# EAGLE design BareBonesArduino (EAGLE 8.0.0)
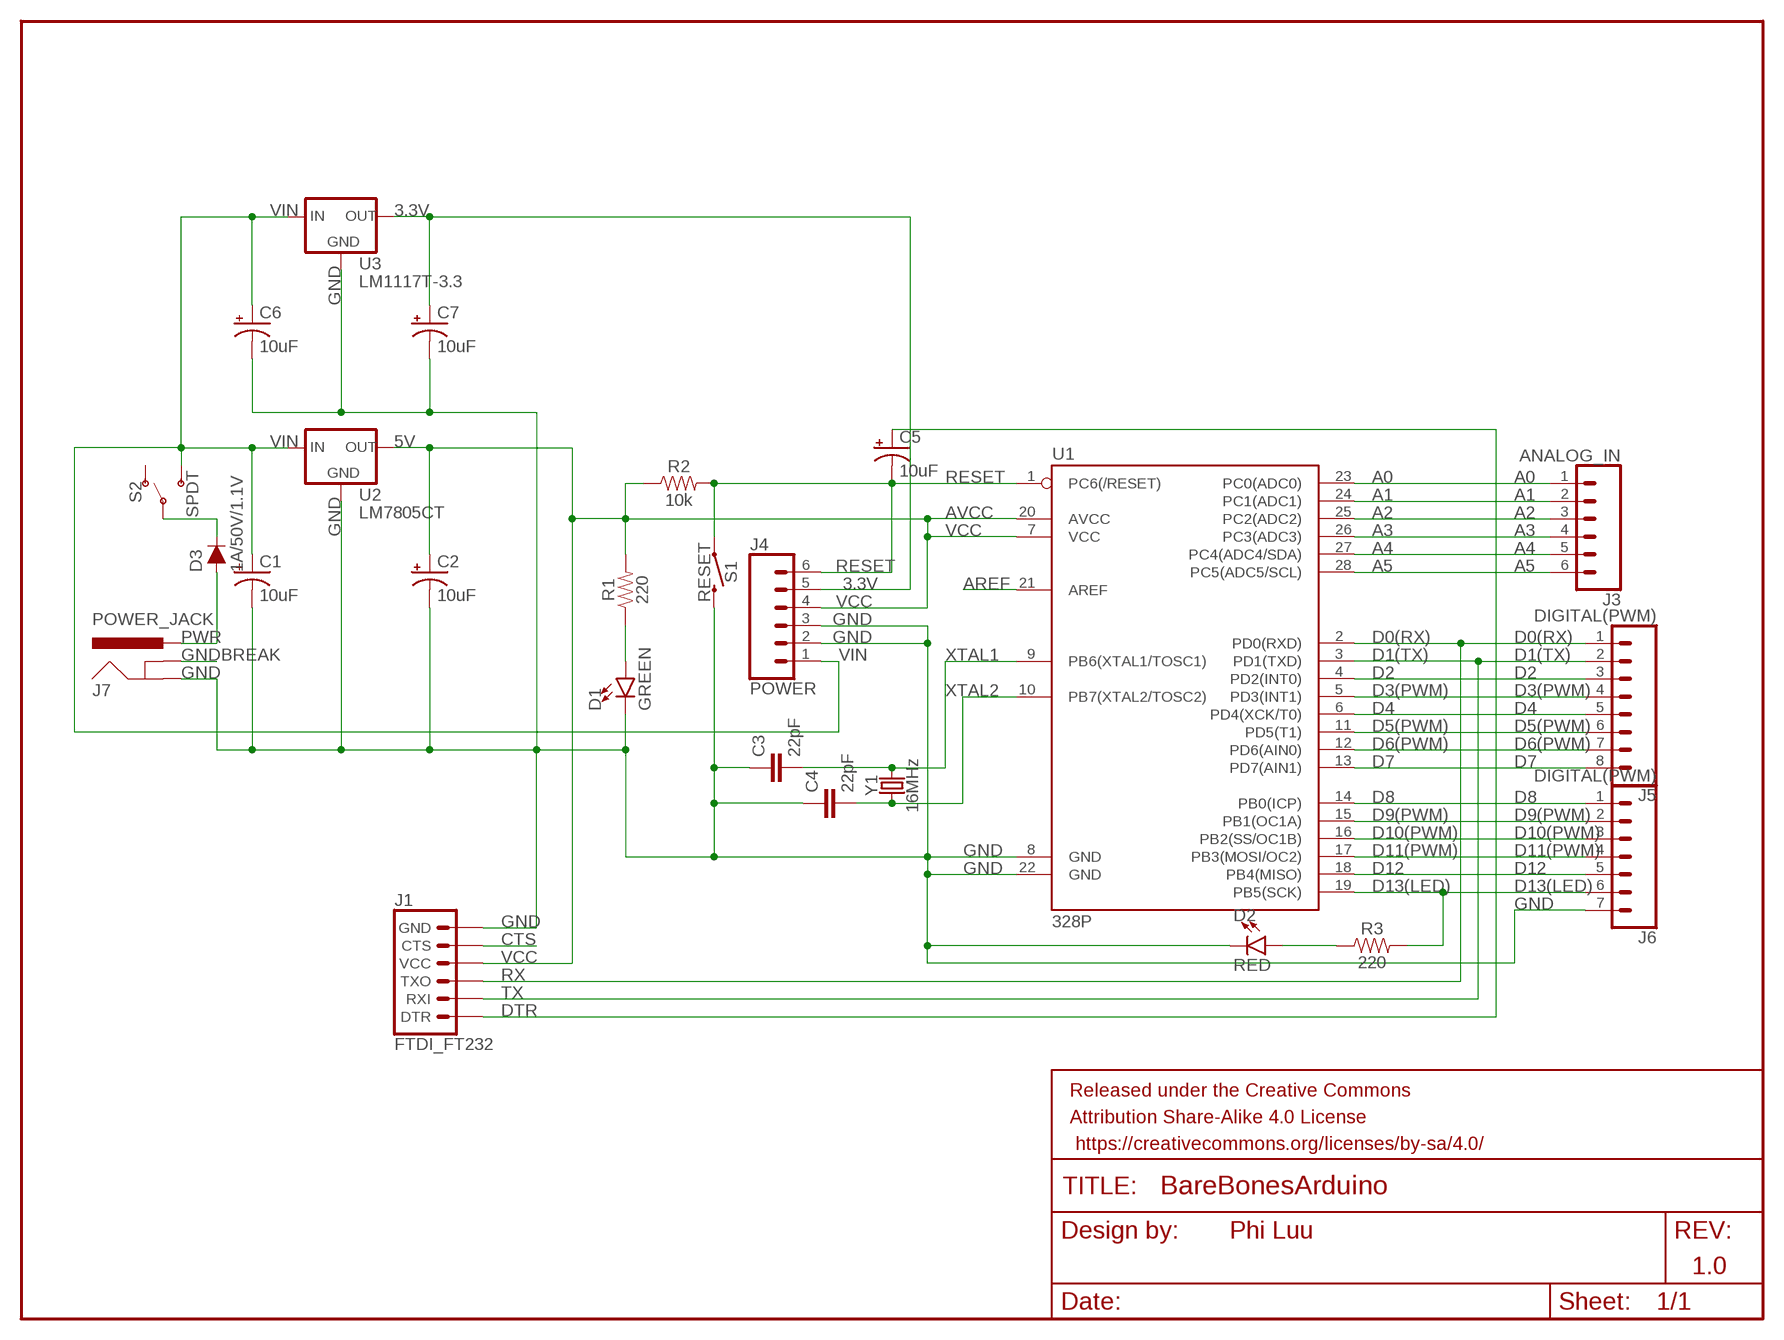
[diagram p0: schematic, sheet 1]

## Parts
C1  10uF  10UF-POLAR-RADIAL-2.5MM-25V-20%  [CPOL-RADIAL-2.5MM-5MM]
C2  10uF  10UF-POLAR-RADIAL-2.5MM-25V-20%  [CPOL-RADIAL-2.5MM-5MM]
C3  22pF  22PF-PTH-2.54MM-200V-5%  [CAP-PTH-2.54]
C4  22pF  22PF-PTH-2.54MM-200V-5%  [CAP-PTH-2.54]
C5  10uF  10UF-POLAR-RADIAL-2.5MM-25V-20%  [CPOL-RADIAL-2.5MM-5MM]
C6  10uF  10UF-POLAR-RADIAL-2.5MM-25V-20%  [CPOL-RADIAL-2.5MM-5MM]
C7  10uF  10UF-POLAR-RADIAL-2.5MM-25V-20%  [CPOL-RADIAL-2.5MM-5MM]
D1  GREEN  LED5MM  [LED_5MM]
D2  RED  LED5MM  [LED_5MM]
D3  1A/50V/1.1V  DIODE-PTH  [DIODE-1N4001]
FRAME1  FRAME-LETTER  [CREATIVE_COMMONS]
J1  FTDI_FT232  6_PIN_SERIAL_TARGET  [1X06]
J3  ANALOG_IN  CONN_06SILK_FEMALE_PTH  [1X06]
J4  POWER  CONN_06SILK_FEMALE_PTH  [1X06]
J5  DIGITAL(PWM)  CONN_08"  [1X08]
J6  DIGITAL(PWM)  CONN_07  [1X07]
J7  POWER_JACK  [POWER_JACK_PTH]
R1  220  1KOHM-HORIZ-1/4W-5%  [AXIAL-0.3]
R2  10k  10KOHM-HORIZ-1/4W-5%  [AXIAL-0.3]
R3  220  1KOHM-HORIZ-1/4W-5%  [AXIAL-0.3]
S1  RESET  MOMENTARY-SWITCH-SPST-PTH-6.0MM  [TACTILE_SWITCH_PTH_6.0MM]
S2  SPDT  SWITCH-SPDT-PTH-11.6X4.0MM  [SWITCH_SPDT_PTH_11.6X4.0MM]
U1  328P  ATMEGA328P_PDIP  [DIP28]
U2  LM7805CT  V_REG_78XX-TO-220  [TO-220-ALT]
U3  LM1117T-3.3  V_REG_LD1117VXX  [78XXL]
Y1  16MHz  CRYSTAL-16MHZPTH-HC49US  [HC49US]

## Nets
3.3V: C7.1(+) J4.5 U3.GND(OUT)
A0: J3.1 U1.23(PC0(ADC0))
A1: J3.2 U1.24(PC1(ADC1))
A2: J3.3 U1.25(PC2(ADC2))
A3: J3.4 U1.26(PC3(ADC3))
A4: J3.5 U1.27(PC4(ADC4/SDA))
A5: J3.6 U1.28(PC5(ADC5/SCL))
AREF: U1.21(AREF)
CTS: J1.5(CTS)
D0(RX): J1.3(TXO) J5.1 U1.2(PD0(RXD))
D1(TX): J1.2(RXI) J5.2 U1.3(PD1(TXD))
D2: J5.3 U1.4(PD2(INT0))
D3(PWM): J5.4 U1.5(PD3(INT1))
D4: J5.5 U1.6(PD4(XCK/T0))
D5(PWM): J5.6 U1.11(PD5(T1))
D6(PWM): J5.7 U1.12(PD6(AIN0))
D7: J5.8 U1.13(PD7(AIN1))
D8: J6.1 U1.14(PB0(ICP))
D9(PWM): J6.2 U1.15(PB1(OC1A))
D10(PWM): J6.3 U1.16(PB2(SS/OC1B))
D11(PWM): J6.4 U1.17(PB3(MOSI/OC2))
D12: J6.5 U1.18(PB4(MISO))
D13(LED): J6.6 R3.P$2 U1.19(PB5(SCK))
DTR: C5.1(+) J1.1(DTR)
GND: C1.2(-) C2.2(-) C3.1 C4.1 C6.2(-) C7.2(-) D1.K(C) D2.K(C) J1.6(GND) J4.2 J4.3 J6.7 J7.GND S1.3 U1.8(GND) U1.22(GND) U2.GND U3.IN(GND)
GNDBREAK: J7.GNDBREAK
N$1: D2.A R3.P$1
N$2: D3.C S2.2(P)
N$3: D1.A R1.P$1
PWR: D3.A J7.PWR
RESET: C5.2(-) J4.6 R2.P$2 S1.1 U1.1(PC6(/RESET))
VCC: C2.1(+) J1.4(VCC) J4.4 R1.P$2 R2.P$1 U1.7(VCC) U1.20(AVCC) U2.OUT
VIN: C1.1(+) C6.1(+) J4.1 S2.3(S) U2.IN U3.OUT(IN)
XTAL1: C3.2 U1.9(PB6(XTAL1/TOSC1)) Y1.2
XTAL2: C4.2 U1.10(PB7(XTAL2/TOSC2)) Y1.1
Unconnected: S2.1(O)

## Notes on the sheet
- 5V
- AVCC
- GND
- RX
- TX
- Phi Luu
- 1.0

## Library data of the parts
C1 C2 C5-C7 = SparkFun-Capacitors:10UF-POLAR: 10.0µF polarized capacitors A capacitor is a passive two-terminal electrical component used to store electrical energy temporarily in an electric field.; PROD_ID: CAP-08440
C3 C4 = SparkFun-Capacitors:22PF: 22pF ceramic capacitors A capacitor is a passive two-terminal electrical component used to store electrical energy temporarily in an electric field.; PROD_ID: CAP-09128
D1 D2 = SparkFun-LED:LED: LED (Generic) Standard schematic elements and footprints for 5mm, 3mm, 1206, and 0603 sized LEDs. Generic LEDs with no color specified.
D3 = SparkFun-DiscreteSemi:DIODE: Diode These are standard reverse protection diodes and small signal diodes. SparkFun Products: SparkFun SparkPunk Sound Kit <https://www.sparkfun.com/products/11177> SparkFun ESP8266 Thing <https://www.sparkfun.com/products/13231>; PROD_ID: DIO-09176
FRAME1 = SparkFun-Aesthetics:FRAME-LETTER: Schematic Frame - Letter Standard 8.5x11 US Letter frame
J1 = SparkFun-Connectors:6_PIN_SERIAL_TARGET: 6-pin header connection for use with the "FTDI BASIC" pinout - TARGET SIDE. Also known as "Arduino Serial Program Header". It is used to mate with our FTDI Basic serial programmers using the Arduino IDE. Note, this device has "TARGET" in the name. It is intended to be used on a design that contains a target micro-controller that you wish to program. The "sister" device, named "CABLE" is inteneded to be used on a design that usually lives on the end of your USB cable and prvides the converter chip (FTDI232 or FTDI231x) to commnicate serial RX/TX. You can populate with some of these: Break Away Headers - Straight <https://www.sparkfun.com/products/116> (PRT-00116) For reference (or to suit your programming needs) check out these designs: SparkFun FTDI Basic Breakout - 5V <https://www.sparkfun.com/products/9716> (DEV-09716) SparkFun FTDI Basic Breakout - 3.3V <https://www.sparkfun.com/products/9873> (DEV-09873) SparkFun FTDI SmartBasic <https://www.sparkfun.com/products/12935> (DEV-12935) SparkFun Beefy 3 - FTDI Basic Breakout <https://www.sparkfun.com/products/13746> (DEV-13746)
J3 J4 = SparkFun-Connectors:CONN_06: Multi connection point. Often used as Generic Header-pin footprint for 0.1 inch spaced/style header connections On any of the 0.1 inch spaced packages, you can populate with these: Break Away Headers - Straight <https://www.sparkfun.com/products/116> (PRT-00116) Break Away Male Headers - Right Angle <https://www.sparkfun.com/products/553> (PRT-00553) Female Headers <https://www.sparkfun.com/products/115> (PRT-00115) Break Away Headers - Machine Pin <https://www.sparkfun.com/products/117> (PRT-00117) Break Away Female Headers - Swiss Machine Pin <https://www.sparkfun.com/products/743> (PRT-00743) Arduino Stackable Header - 6 Pin <https://www.sparkfun.com/products/9280> (PRT-09280) For SCREWTERMINALS and SPRING TERMINALS visit here: Screw Terimnals on SparkFun.com <https://www.sparkfun.com/search/results?term=Screw+Terminals> (5mm/3.5mm/2.54mm spacing) This device is also useful as a general connection point to wire up your design to another part of your project. Our various solder wires solder well into these plated through hole pads. Hook-Up Wire - Assortment (Stranded, 22 AWG) <https://www.sparkfun.com/products/11375> (PRT-11375) Hook-Up Wire - Assortment (Solid Core, 22 AWG) <https://www.sparkfun.com/products/11367> (PRT-11367) View the entire wire category on our website here <https://www.sparkfun.com/categories/141>; PROD_ID: CONN-08437
J5 = SparkFun-Connectors:CONN_08: Multi connection point. Often used as Generic Header-pin footprint for 0.1 inch spaced/style header connections On any of the 0.1 inch spaced packages, you can populate with these: Break Away Headers - Straight <https://www.sparkfun.com/products/116> (PRT-00116) Break Away Male Headers - Right Angle <https://www.sparkfun.com/products/553> (PRT-00553) Female Headers <https://www.sparkfun.com/products/115> (PRT-00115) Break Away Headers - Machine Pin <https://www.sparkfun.com/products/117> (PRT-00117) Break Away Female Headers - Swiss Machine Pin <https://www.sparkfun.com/products/743> (PRT-00743) Arduino Stackable Header - 8 Pin <https://www.sparkfun.com/products/9279> (PRT-09279) For SCREWTERMINALS and SPRING TERMINALS visit here: Screw Terimnals on SparkFun.com <https://www.sparkfun.com/search/results?term=Screw+Terminals> (5mm/3.5mm/2.54mm spacing) This device is also useful as a general connection point to wire up your design to another part of your project. Our various solder wires solder well into these plated through hole pads. Hook-Up Wire - Assortment (Stranded, 22 AWG) <https://www.sparkfun.com/products/11375> (PRT-11375) Hook-Up Wire - Assortment (Solid Core, 22 AWG) <https://www.sparkfun.com/products/11367> (PRT-11367) View the entire wire category on our website here <https://www.sparkfun.com/categories/141> Special notes: Molex polarized connector foot print use with SKU : PRT-08231 with associated crimp pins and housings. 1MM SMD Version SKU: PRT-10208 NOTES ON THE VARIANTS LOCK and LOCK_LONGPADS... This footprint was designed to help hold the alignment of a through-hole component (i.e. 6-pin header) while soldering it into place. You may notice that each hole has been shifted either up or down by 0.005 of an inch from it's more standard position (which is a perfectly straight line). This slight alteration caused the pins (the squares in the middle) to touch the edges of the holes. Because they are alternating, it causes a "brace" to hold the component in place. 0.005 has proven to be the perfect amount of "off-center" position when using our standard breakaway headers. Although looks a little odd when you look at the bare footprint, once you have a header in there, the alteration is very hard to notice. Also,if you push a header all the way into place, it is covered up entirely on the bottom side.; PROD_ID: CONN-08438
J6 = SparkFun-Connectors:CONN_07: Multi connection point. Often used as Generic Header-pin footprint for 0.1 inch spaced/style header connections On any of the 0.1 inch spaced packages, you can populate with these: Break Away Headers - Straight <https://www.sparkfun.com/products/116> (PRT-00116) Break Away Male Headers - Right Angle <https://www.sparkfun.com/products/553> (PRT-00553) Female Headers <https://www.sparkfun.com/products/115> (PRT-00115) Break Away Headers - Machine Pin <https://www.sparkfun.com/products/117> (PRT-00117) Break Away Female Headers - Swiss Machine Pin <https://www.sparkfun.com/products/743> (PRT-00743) For SCREWTERMINALS and SPRING TERMINALS visit here: Screw Terimnals on SparkFun.com <https://www.sparkfun.com/search/results?term=Screw+Terminals> (5mm/3.5mm/2.54mm spacing) This device is also useful as a general connection point to wire up your design to another part of your project. Our various solder wires solder well into these plated through hole pads. Hook-Up Wire - Assortment (Stranded, 22 AWG) <https://www.sparkfun.com/products/11375> (PRT-11375) Hook-Up Wire - Assortment (Solid Core, 22 AWG) <https://www.sparkfun.com/products/11367> (PRT-11367) View the entire wire category on our website here <https://www.sparkfun.com/categories/141> Special notes: Molex polarized connector foot print use with SKU : PRT-08231 with associated crimp pins and housings. 1MM SMD Version SKU: PRT-10208 NOTES ON THE VARIANTS LOCK and LOCK_LONGPADS... This footprint was designed to help hold the alignment of a through-hole component (i.e. 6-pin header) while soldering it into place. You may notice that each hole has been shifted either up or down by 0.005 of an inch from it's more standard position (which is a perfectly straight line). This slight alteration caused the pins (the squares in the middle) to touch the edges of the holes. Because they are alternating, it causes a "brace" to hold the component in place. 0.005 has proven to be the perfect amount of "off-center" position when using our standard breakaway headers. Although looks a little odd when you look at the bare footprint, once you have a header in there, the alteration is very hard to notice. Also,if you push a header all the way into place, it is covered up entirely on the bottom side.
J7 = SparkFun-Connectors:POWER_JACK: Power Jack Connector This is the standard 5.5mm barrel jack for power. The PTH is the most common, proven, reliable, footprint. The Slot footprint only works if the mill layer is transmitted to the PCB fab house so be warned. Here are the connectors we sell at SparkFun: DC Barrel Power Jack/Connector <https://www.sparkfun.com/products/119> (PRT-00119) DC Barrel Power Jack/Connector (SMD) <https://www.sparkfun.com/products/12748> (PRT-12748) DC Barrel Jack Adapter - Breadboard Compatible <https://www.sparkfun.com/products/10811> (PRT-10811) It is used on this SparkFun product (and many, many others): SparkFun RedBoard - Programmed with Arduino <https://www.sparkfun.com/products/12757> (DEV-12757) Also, if you need a mating power supply or connector, please check these out: Wall Adapter Power Supply - 9VDC 650mA <https://www.sparkfun.com/products/298> (TOL-00298) DC Barrel Jack Adapter - Male <https://www.sparkfun.com/products/10287> (PRT-10287); PROD_ID: CONN-08197
R1 R3 = SparkFun-Resistors:1KOHM: 1kΩ resistor A resistor is a passive two-terminal electrical component that implements electrical resistance as a circuit element. Resistors act to reduce current flow, and, at the same time, act to lower voltage levels within circuits. - Wikipedia; PROD_ID: RES-08380; VALUE: 1k
R2 = SparkFun-Resistors:10KOHM: 10kΩ resistor A resistor is a passive two-terminal electrical component that implements electrical resistance as a circuit element. Resistors act to reduce current flow, and, at the same time, act to lower voltage levels within circuits. - Wikipedia; PROD_ID: RES-09435
S1 = SparkFun-Switches:MOMENTARY-SWITCH-SPST: Momentary Switch (Pushbutton) - SPST Normally-open (NO) SPST momentary switches (buttons, pushbuttons). Variants PTH-12MM - 12mm square, through-hole Momentary Pushbutton Switch - 12mm Square <https://www.sparkfun.com/products/9190> (COM-09190) PTH-6.0MM, PTH-6.0MM-KIT - 6.0mm square, through-hole Mini Pushbutton Switch <https://www.sparkfun.com/products/97> (COM-00097) KIT package intended for soldering kit's - only one side of pads' copper is exposed. PTH-RIGHT-ANGLE-KIT - Right-angle, through-hole Right Angle Tactile Button <https://www.sparkfun.com/products/10791> - Used on SparkFun BigTime Watch Kit <https://www.sparkfun.com/products/11734> SMD-12MM - 12mm square, surface-mount Tactile Button - SMD (12mm) <https://www.sparkfun.com/products/12993> (COM-12993) Used on SparkFun PicoBoard <https://www.sparkfun.com/products/11888> SMD-4.5MM - 4.5mm Square Trackball Switch Used on SparkFun Blackberry Trackballer Breakout <https://www.sparkfun.com/products/13169> SMD-4.6MMX2.8MM - 4.60mm x 2.80mm, surface mount Used on SparkFun SAMD21 Mini Breakout <https://www.sparkfun.com/products/13664> SMD-5.2MM, SMD-5.2-REDUNDANT - 5.2mm square, surface-mount Mini Pushbutton Switch - SMD <https://www.sparkfun.com/products/8720> (COM-08720) Used on Arduino Pro Mini <https://www.sparkfun.com/products/11114> REDUNDANT package connects both switch circuits together SMD-6.0X3.5MM - 6.0 x 3.5mm, surface mount Momentary Reset Switch SMD <https://www.sparkfun.com/products/8229> (COM-08229) SMD-6.2MM-TALL - 6.2mm square, surface mount Tactile Button - SMD (6mm) <https://www.sparkfun.com/products/12992> Used on SparkFun Digital Sandbox <https://www.sparkfun.com/products/12651> SMD-RIGHT-ANGLE - Right-angle, surface mount Used on SparkFun Block for Intel® Edison - Arduino <https://www.sparkfun.com/products/13036>; PROD_ID: SWCH-08441; SF_SKU: COM-00097
S2 = SparkFun-Switches:SWITCH-SPDT: Single Pole, Double Throw (SPDT) Switch Single-pole, double-throw (SPDT) switch. Variant Overview SMD-AYZ0202 Surface Mount DPDT Switch <https://www.sparkfun.com/products/597> (COM-00597) Used on e.g. LilyPad Arduino USB - ATmega32U4 Board <https://www.sparkfun.com/products/12049> PTH-11.6X4.0MM SPDT Mini Power Switch <https://www.sparkfun.com/products/102> (COM-00102) Used on e.g. SparkFun Simon Says - Through-Hole Soldering Kit <https://www.sparkfun.com/products/10547> (KIT-10547) PTH-11.6X4.0MM-KIT KIT version of SPDT Mini Power Switch - Simplifies soldering by removing tStop of switch pins - only one side can be soldered. PTH-11.6X4.0MM-LOCK LOCK version of SPDT Mini Power Switch - Offset pins hold switch in place for easier soldering. SMD-RIGHT-ANGLE Surface Mount Right Angle Switch <https://www.sparkfun.com/products/10860> (COM-10860) Used on e.g. SparkFun ESP8266 Thing <https://www.sparkfun.com/products/13231>; PROD_ID: SWCH-08261; SF_SKU: COM-00102
U1 = SparkFun-IC-Microcontroller:ATMEGA328P_PDIP: Atmel 328P Through hole ATMEGA328P uC used in the Arduino 32kb flash, 1k EEPROM, 2k SRAM Datasheet <http://www.sparkfun.com/datasheets/Components/SMD/ATMega328.pdf> SparkFun Products Storefront component: AVR 28 Pin 20MHz 32K 6A/D - ATMega328P <https://www.sparkfun.com/products/9061> (COM-09061) SparkFun Simon Says - Through-Hole Soldering Kit <https://www.sparkfun.com/products/10547> (KIT-10547) SparkFun Learn to Solder - Simon Says <https://www.sparkfun.com/products/13708> (KIT-13708) SparkFun BigTime Watch Kit <https://www.sparkfun.com/products/11734> (KIT-11734) SparkFun ClockIt <https://www.sparkfun.com/products/10930> (KIT-10930) SparkFun Serial Enabled LCD Kit <https://www.sparkfun.com/products/10097> (LCD-10097) SparkFun Simon Tilts - Through Hole Soldering Kit <https://www.sparkfun.com/products/12634> (KIT-12634) SparkFun Frequency Counter Kit <https://www.sparkfun.com/products/10140> (KIT-10140) FabFM Radio Kit <https://www.sparkfun.com/products/11043> (KIT-11043) SparkFun Binary Blaster Kit <https://www.sparkfun.com/products/12037> (KIT-12037) SparkFun Metro-Gnome <https://www.sparkfun.com/products/9236> (KIT-09236) ATmega328 with Arduino Optiboot (Uno) <https://www.sparkfun.com/products/10524> (DEV-10524); PROD_ID: IC-09136
U2 = SparkFun-IC-Power:V_REG_78XX: Voltage Regulator Standard 78xx regulator. IGO (Input Ground Output). Spark Fun Electronics SKU : COM-00107; PROD_ID: VREG-08450; SF_ID: COM-00107
U3 = SparkFun-IC-Power:V_REG_LD1117VXX: LD1117VXX voltage regulator. We carry the 3.3V version (COM-00526) in TO-220 package.
Y1 = SparkFun-Clocks:CRYSTAL-16MHZ: 16MHz Crystal Digikey Example <http://www.digikey.com/product-search/en?keywords=535-9122-1-ND> Frequency: 16MHz Frequency Stability: ±50ppm Frequency Tolerance: ±20ppm Load Capacitance: 18pF SparkFun Products: Pro Micro -5V/16MHz <https://www.sparkfun.com/products/12640> SparkFun Serial Enabled LCD Kit <https://www.sparkfun.com/products/10097>; PROD_ID: XTAL-08181; SF_ID: COM-00536

## Board
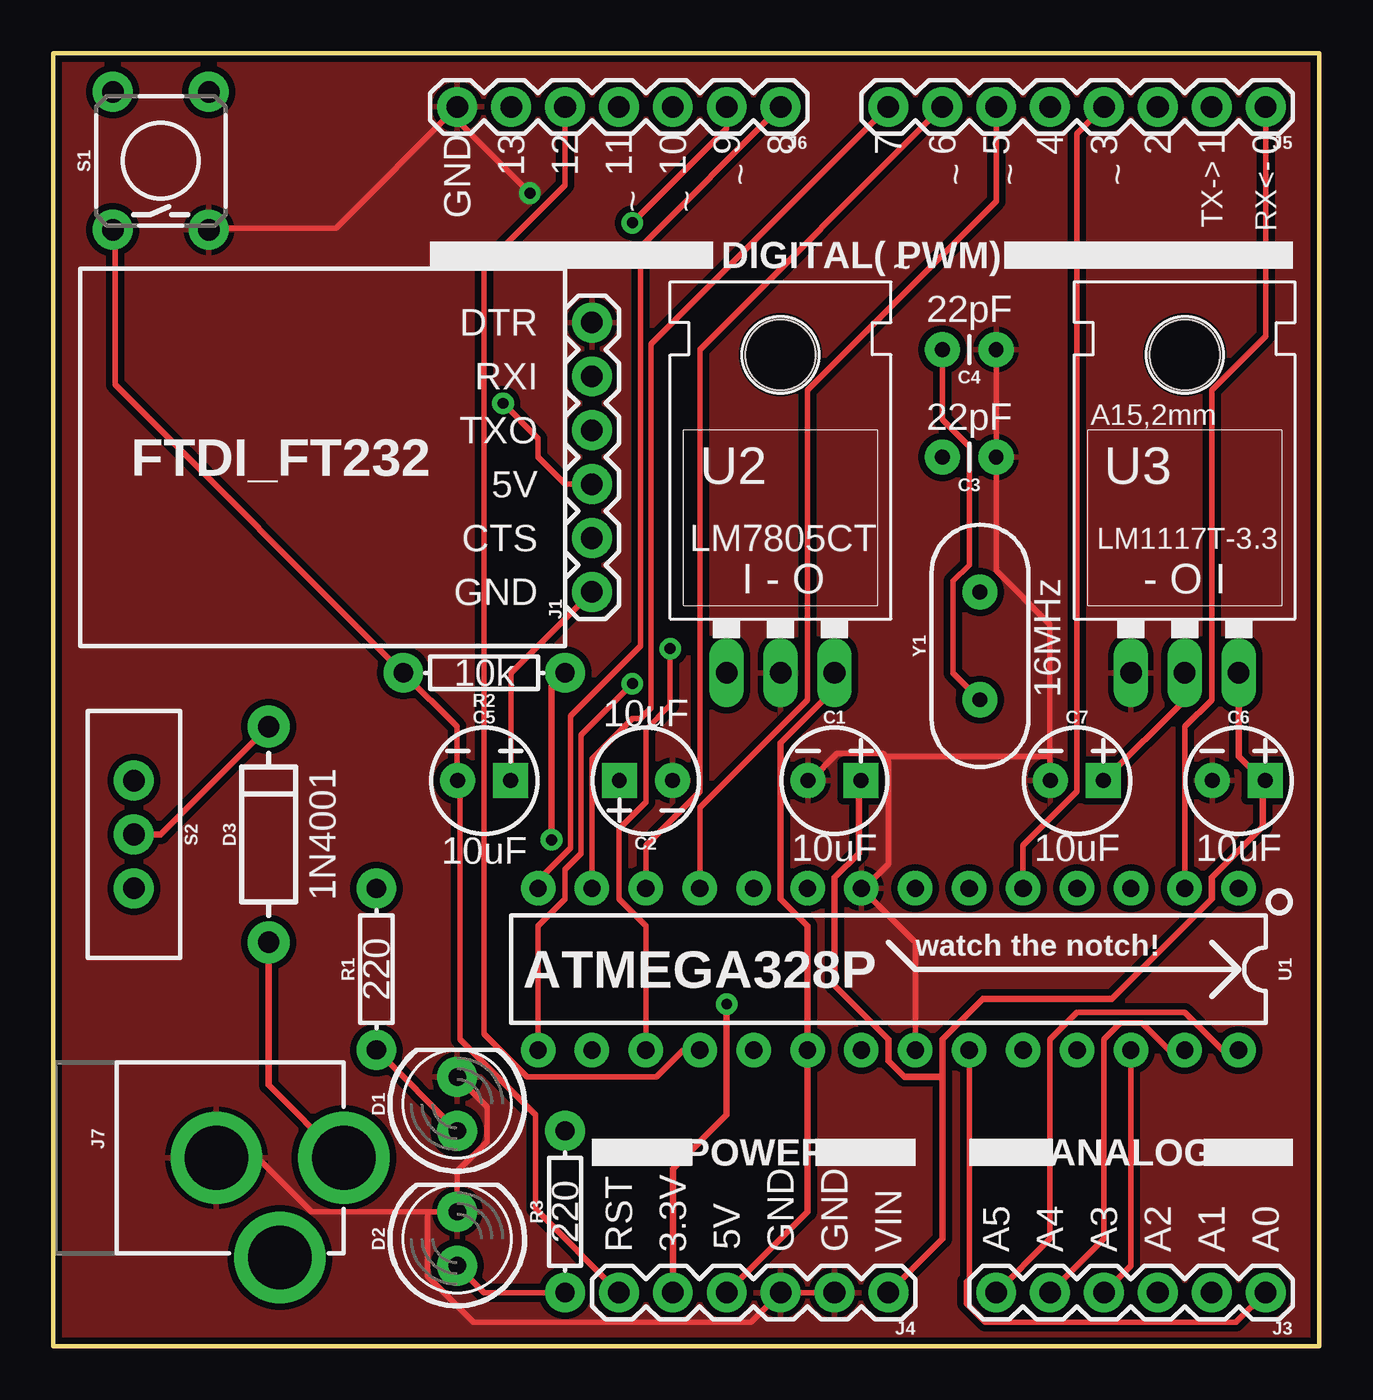
[diagram p1: board, top side]
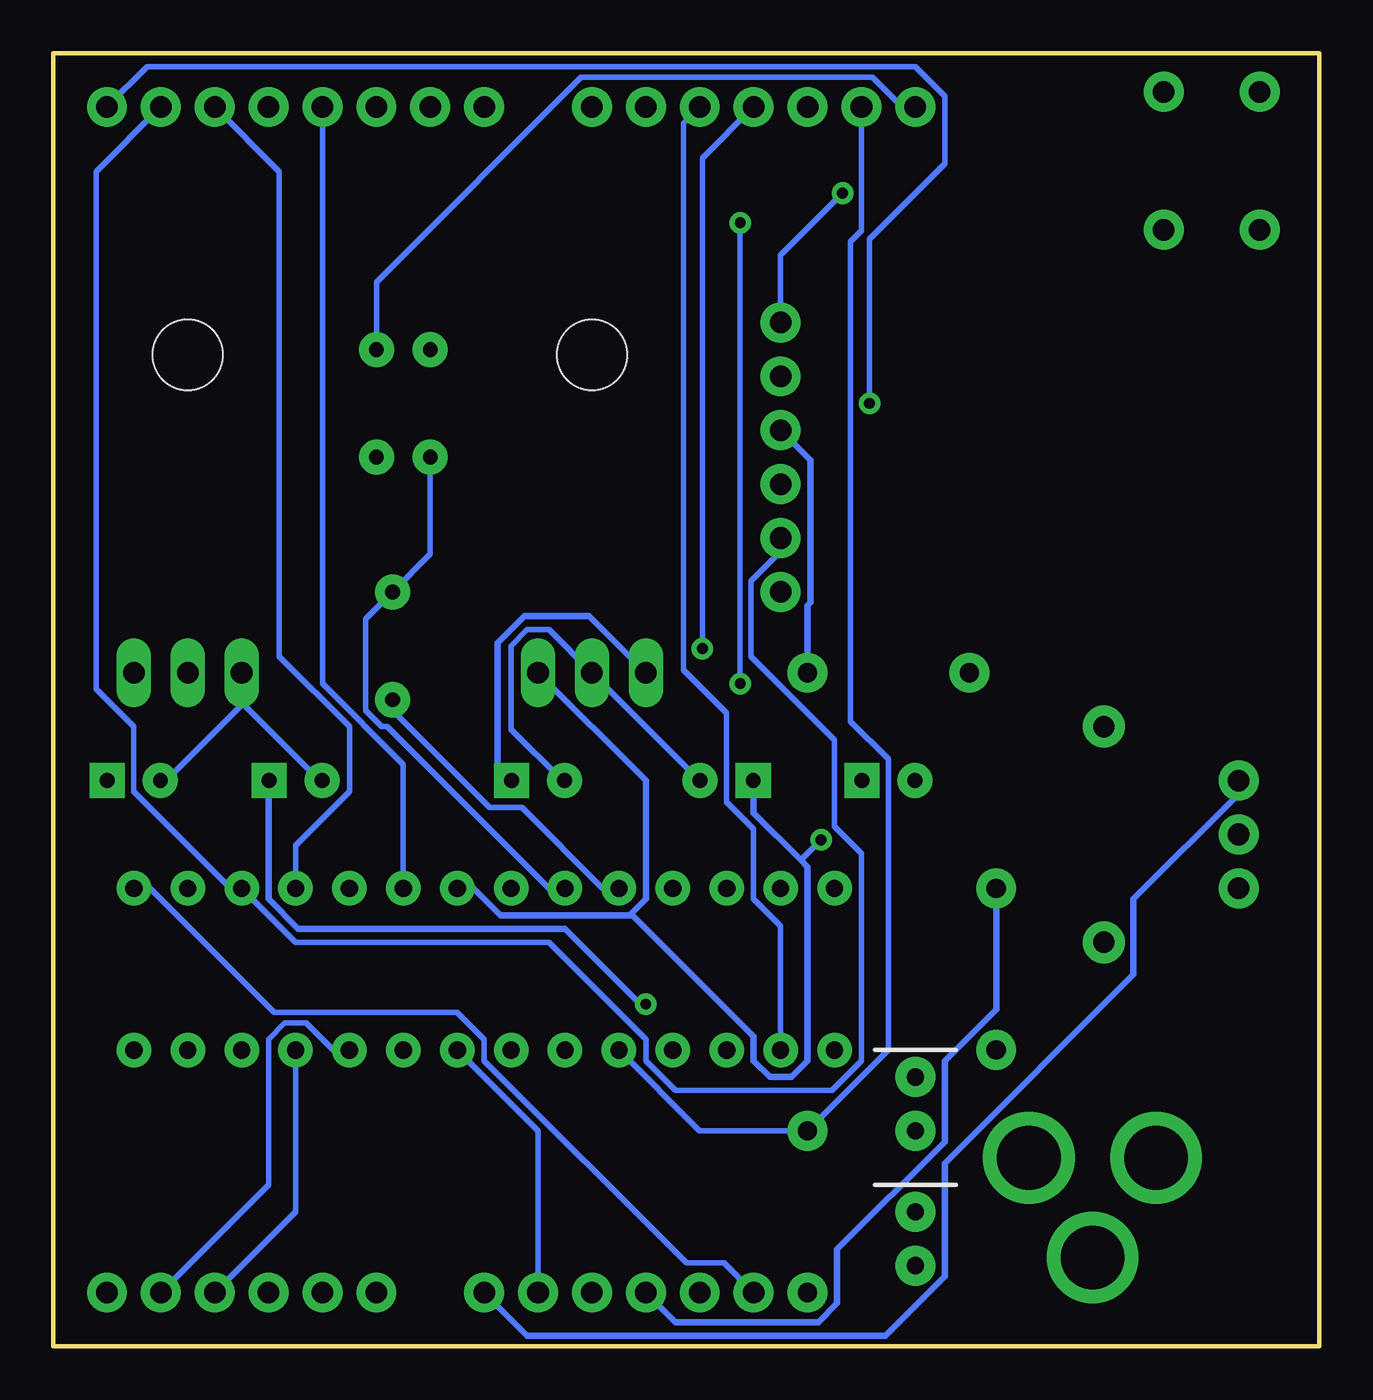
[diagram p2: board, bottom side, seen from below]

Size 59.69 x 60.96 mm. Coordinates in mm from the lower left corner, seen from the top.
Outline: 0,0 0,60.96 59.69,60.96 59.69,0 0,0
Copper layers (1*16): Top 0.035mm / dielectric 1.5mm / Bottom 0.035mm
Design rules "SparkFun": minimum track width 8mil, minimum drill 20mil, track to track 8mil, track to pad 8mil, pad to pad 8mil, via to via 8mil, smd to smd 8mil, copper to edge 10mil, drill to drill 8mil, minimum pad ring 12mil, minimum via ring 10mil, stop-mask expansion 4mil, vias tented up to drill 25mil, thermal gap 10mil

### Footprints (pad centres in the part's own frame; a part is rotated, then mirrored left to right if it is on the bottom)
CPOL-RADIAL-2.5MM-5MM = drill 0.7 pad 1.651 square: 1 1.25,0 | drill 0.7 pad 1.651: 2 -1.25,0
CAP-PTH-2.54 = drill 0.7 pad 1.651: 1 -1.27,0; 2 1.27,0
LED_5MM = drill 0.813 pad 1.88: A -1.27,0; K 1.27,0
DIODE-1N4001 = drill 1 pad 1.981: A -5.08,0; C 5.08,0
1X06 = drill 1.016 pad 1.88: 1 0,0; 2 2.54,0; 3 5.08,0; 4 7.62,0; 5 10.16,0; 6 12.7,0
1X08 = drill 1.016 pad 1.88: 1 0,0; 2 2.54,0; 3 5.08,0; 4 7.62,0; 5 10.16,0; 6 12.7,0; 7 15.24,0; 8 17.78,0
1X07 = drill 1.016 pad 1.88: 1 0,0; 2 2.54,0; 3 5.08,0; 4 7.62,0; 5 10.16,0; 6 12.7,0; 7 15.24,0
POWER_JACK_PTH = drill 2.997 pad 4.318: GND 0,7.7; GNDBREAK 4.7,10.7; PWR 0,13.7
AXIAL-0.3 = drill 0.9 pad 1.88: P$1 -3.81,0; P$2 3.81,0
TACTILE_SWITCH_PTH_6.0MM = drill 1.016 pad 1.88: 1 -3.251,2.261; 2 3.251,2.261; 3 -3.251,-2.261; 4 3.251,-2.261
SWITCH_SPDT_PTH_11.6X4.0MM = drill 1.016 pad 1.88: 1 0,2.54; 2 0,0; 3 0,-2.54
DIP28 = drill 0.813 pad 1.626: 1 -16.51,-3.81; 2 -13.97,-3.81; 3 -11.43,-3.81; 4 -8.89,-3.81; 5 -6.35,-3.81; 6 -3.81,-3.81; 7 -1.27,-3.81; 8 1.27,-3.81; 9 3.81,-3.81; 10 6.35,-3.81; 11 8.89,-3.81; 12 11.43,-3.81; 13 13.97,-3.81; 14 16.51,-3.81; 15 16.51,3.81; 16 13.97,3.81; 17 11.43,3.81; 18 8.89,3.81; 19 6.35,3.81; 20 3.81,3.81; 21 1.27,3.81; 22 -1.27,3.81; 23 -3.81,3.81; 24 -6.35,3.81; 25 -8.89,3.81; 26 -11.43,3.81; 27 -13.97,3.81; 28 -16.51,3.81
TO-220-ALT = drill 1.016 long: GND 0,-3.81; IN -2.54,-3.81; OUT 2.54,-3.81 | hole 3.302: 0,11.176
78XXL = drill 1.016 long: GND 0,-3.81; IN -2.54,-3.81; OUT 2.54,-3.81 | hole 3.302: 0,11.176
HC49US = drill 0.7 pad 1.651: 1 -2.54,0; 2 2.54,0

### Placement (x,y rotation side)
C1  36.83,26.67 0 top
C2  27.94,26.67 180 top
C3  43.18,41.91 180 top
C4  43.18,46.99 180 top
C5  20.32,26.67 0 top
C6  55.88,26.67 0 top
C7  48.26,26.67 0 top
D1  19.05,11.43 90 top
D2  19.05,5.08 90 top
D3  10.16,24.13 90 top
FRAME1  0,-7.62 0 top  (outside the outline)
J1  25.4,35.56 90 top
J3  57.15,2.54 180 top
J4  39.37,2.54 180 top
J5  57.15,58.42 180 top
J6  34.29,58.42 180 top
J7  0,8.89 270 top
R1  15.24,17.78 90 top
R2  20.32,31.75 180 top
R3  24.13,6.35 90 top
S1  5.08,55.88 90 top
S2  3.81,24.13 180 top
U1  39.37,17.78 180 top
U2  34.29,35.56 0 top
U3  53.34,35.56 0 top
Y1  43.69,33.02 90 top

### Tracks (layer width: path | path; a pad name or v marks a point on that pad's centre or on a via)
3.3V  (via drill 0.51)
  Top 0.305: U3.GND 53.34,30.48 49.53,26.67 C7.1 | J4.5 29.21,8.38 31.75,10.92 v31.75,16.13
  Bottom 0.305: C7.1 49.53,26.67 49.53,21.08 48.13,19.68 35.56,19.68 32,16.13 v31.75,16.13
A0
  Top 0.254: U1.23 43.18,3.17 43.05,3.05 43.05,2.03 43.94,1.14 55.75,1.14 J3.1
A1
  Bottom 0.254: U1.24 46.48,13.97 47.75,15.24 48.77,15.24 49.53,14.48 49.53,7.62 J3.2
A2
  Bottom 0.254: U1.25 48.26,6.35 J3.3
A3
  Top 0.254: U1.26 50.8,3.81 J3.4
A4
  Top 0.254: U1.27 52.58,13.97 51.31,15.24 50.29,15.24 49.53,14.48 49.53,5.08 J3.5
A5
  Top 0.254: U1.28 55.12,13.97 53.34,15.75 48.26,15.75 46.99,14.48 46.99,5.08 J3.6
D0(RX)  (via drill 0.51)
  Top 0.254: U1.2 53.34,29.21 54.61,30.48 54.61,45.09 57.15,47.62 J5.1 | J1.3 24.13,40.64 22.86,41.91 22.86,42.8 v21.21,44.45
  Bottom 0.254: v21.21,44.45 21.21,52.2 17.65,55.75 17.65,58.93 19.05,60.33 55.24,60.33 J5.1
D1(TX)
  Bottom 0.254: J5.2 57.66,55.37 57.66,30.99 55.88,29.21 55.88,26.16 51.31,21.59 U1.3 48.26,19.05 36.32,19.05 31.75,14.48 31.75,13.46 30.35,12.06 22.99,12.06 21.59,13.46 21.59,23.24 22.86,24.51 22.86,28.57 26.8,32.51 26.8,36.07 25.4,37.47 J1.2
D2
  Bottom 0.254: U1.4 48.26,23.62 45.72,26.16 45.72,29.21 49.02,32.51 49.02,55.37 J5.3
D3(PWM)
  Top 0.254: U1.5 45.72,23.62 48.26,26.16 48.26,57.15 J5.4
D4
  Bottom 0.254: U1.6 43.18,27.43 46.99,31.24 J5.5
D5(PWM)
  Top 0.254: U1.11 30.48,25.4 35.56,30.48 35.56,45.09 44.45,53.98 J5.6
D6(PWM)
  Top 0.254: U1.12 27.94,23.62 30.48,26.16 30.48,46.99 J5.7
D7
  Top 0.254: U1.13 25.4,27.69 27.3,29.59 27.69,29.59 28.19,30.1 28.19,47.24 J5.8
D8
  Top 0.254: U1.14 22.86,21.97 24.38,23.5 24.38,29.72 27.69,33.02 27.69,33.4 27.69,51.82 J6.1
D9(PWM)  (via drill 0.51)
  Top 0.254: U1.15 22.86,19.81 24.13,21.08 24.13,22.48 24.89,23.24 24.89,28.83 v27.3,31.24 | J6.2 31.75,57.4 v27.3,52.96
  Bottom 0.254: v27.3,52.96 v27.3,31.24
D10(PWM)
  Bottom 0.254: U1.16 25.4,19.81 26.67,21.08 26.67,24.38 27.94,25.65 27.94,29.84 29.97,31.88 29.97,57.66 J6.3
D11(PWM)  (via drill 0.51)
  Top 0.254: U1.17 27.94,19.81 26.67,21.08 26.67,24.38 27.94,25.65 27.94,29.08 29.08,30.23 v29.08,32.89
  Bottom 0.254: v29.08,32.89 29.08,56.01 J6.4
D12
  Top 0.254: U1.18 29.72,13.97 28.45,12.7 22.35,12.7 20.32,14.73 20.32,50.93 24.13,54.74 J6.5
D13(LED)
  Bottom 0.254: U1.19 29.21,10.16 R3.P$2 20.32,13.97 20.32,27.69 22.1,29.46 22.1,52.07 21.59,52.58 J6.6
DTR
  Top 0.254: J1.1 21.59,31.75 21.59,26.67 C5.1
GND  (via drill 0.51)
  Top 0.254: D1.K 20.45,11.3 20.45,9.65 19.05,8.26 D2.K 17.65,6.35 | 17.65,6.35 12.19,6.35 9.65,8.89 J7.GND | J4.2 J4.3 32.89,1.14 19.81,1.14 17.65,3.3 17.65,6.35 | U1.22 40.64,19.05 U1.8 38.23,21.59 39.37,22.73 39.37,27.69 39.31,27.75 | 39.31,27.75 39.12,27.94 36.96,27.94 35.69,26.67 C1.2 | S1.3 7.37,52.7 13.34,52.7 J6.7 18.8,58.04 v22.48,54.36 | C4.1 C3.1 44.45,36.58 46.99,34.04 46.99,27.81 | 46.99,27.81 46.99,26.67 C7.2 | 46.99,27.81 39.37,27.81 39.31,27.75
  Bottom 0.254: C2.2 29.21,26.67 U2.GND 36.32,33.78 37.34,33.78 38.1,33.02 38.1,29.08 35.69,26.67 C1.2 | J4.2 36.83,10.16 U1.22 | J1.6 25.4,51.44 v22.48,54.36 | C7.2 47.12,26.67 50.8,30.35 U3.IN 50.8,30.23 54.36,26.67 C6.2 | J6.7 19.68,58.42 21.08,59.82 34.8,59.82 44.45,50.16 C4.1
  pour Top (isolate 0.305): 0,0 0,60.96 59.69,60.96 59.69,0
N$1
  Top 0.254: R3.P$1 20.32,2.54 D2.A
N$2
  Top 0.305: S2.2 5.08,24.13 D3.C
N$3
  Top 0.254: R1.P$1 D1.A
PWR
  Top 0.305: D3.A 10.16,12.32 13.59,8.89 J7.PWR
RESET
  Top 0.254: S1.1 2.92,52.58 2.92,45.34 R2.P$2 19.05,29.21 19.05,26.67 C5.2 19.18,26.67 19.18,14.48 22.73,10.92 22.73,6.48 J4.6
  Bottom 0.254: U1.1 55.12,21.59 49.28,15.75 40.64,15.75 39.37,14.48 39.37,13.46 29.84,3.94 28.07,3.94 J4.6
VCC  (via drill 0.51)
  Top 0.305: J4.4 35.56,6.35 U1.20 35.56,19.81 34.29,21.08 34.29,28.45 36.83,30.99 U2.OUT | R2.P$1 23.5,31.11 v23.5,23.88
  Bottom 0.305: R1.P$2 15.24,15.88 17.65,13.46 17.65,9.65 22.73,4.57 22.73,2.03 23.62,1.14 30.35,1.14 J4.4 | R2.P$1 24.13,34.92 24,35.05 24,41.78 J1.4 | U1.7 39.88,21.59 38.61,20.32 32.51,20.32 | 32.51,20.32 31.75,21.08 31.75,26.67 U2.OUT | 24.45,22.92 24.13,22.61 24.13,13.46 24.89,12.7 25.91,12.7 26.67,13.46 26.67,14.61 32.38,20.32 32.51,20.32 | 24.45,22.92 26.67,25.15 26.67,26.67 C2.1 | 24.45,22.92 v23.5,23.88
VIN
  Top 0.305: U3.OUT 55.88,27.81 57.02,26.67 C6.1 57.02,26.54 57.02,24.51 54.61,22.1 54.61,21.08 49.91,16.38 43.81,16.38 41.91,14.48 41.91,12.7 | 41.91,12.7 41.91,5.08 J4.1 | 41.91,12.7 40.13,12.7 39.37,13.46 39.37,14.48 36.83,17.02 36.83,22.1 37.97,23.24 37.97,26.67 C1.1
  Bottom 0.305: U2.IN 34.42,34.42 37.47,34.42 38.73,33.15 38.73,27.3 38.1,26.67 C1.1 | S2.3 3.81,26.04 8.76,21.08 8.76,17.53 17.65,8.64 17.65,3.3 20.45,0.51 37.34,0.51 J4.1
XTAL1
  Bottom 0.254: U1.9 36.32,21.59 43.94,29.21 44.2,29.21 44.96,29.97 44.96,34.29 Y1.2 41.91,37.34 C3.2
XTAL2
  Top 0.254: C4.2 41.91,43.69 43.18,42.42 43.18,36.83 42.42,36.07 42.42,31.75 Y1.1
  Bottom 0.254: U1.10 33.78,21.59 37.59,25.4 39.12,25.4 43.69,29.97 Y1.1

### Text on the board
tPlace: GND | 13 | 12 | 11 | 10 | 9 | 8 | 7 | 6 | 5 | 4 | 3 | 2 | 1 | 0 | TX-> | RX<- | ~ | ~ | ~ | ~ | ~ | ~ | DIGITAL( PWM) | ~ | 22pF | DTR | RXI | 22pF | TXO | FTDI_FT232 | 5V | CTS | LM7805CT | LM1117T-3.3 | GND | I - O | - O I | 16MHz | 10k | 10uF | 1N4001 | 10uF | 10uF | 10uF | 10uF | 220 | ATMEGA328P | watch the notch! | POWER | ANALOG | 220 | 5V | RST | 3.3V | GND | GND | VIN | A5 | A4 | A3 | A2 | A1 | A0
tDocu: Phi Luu